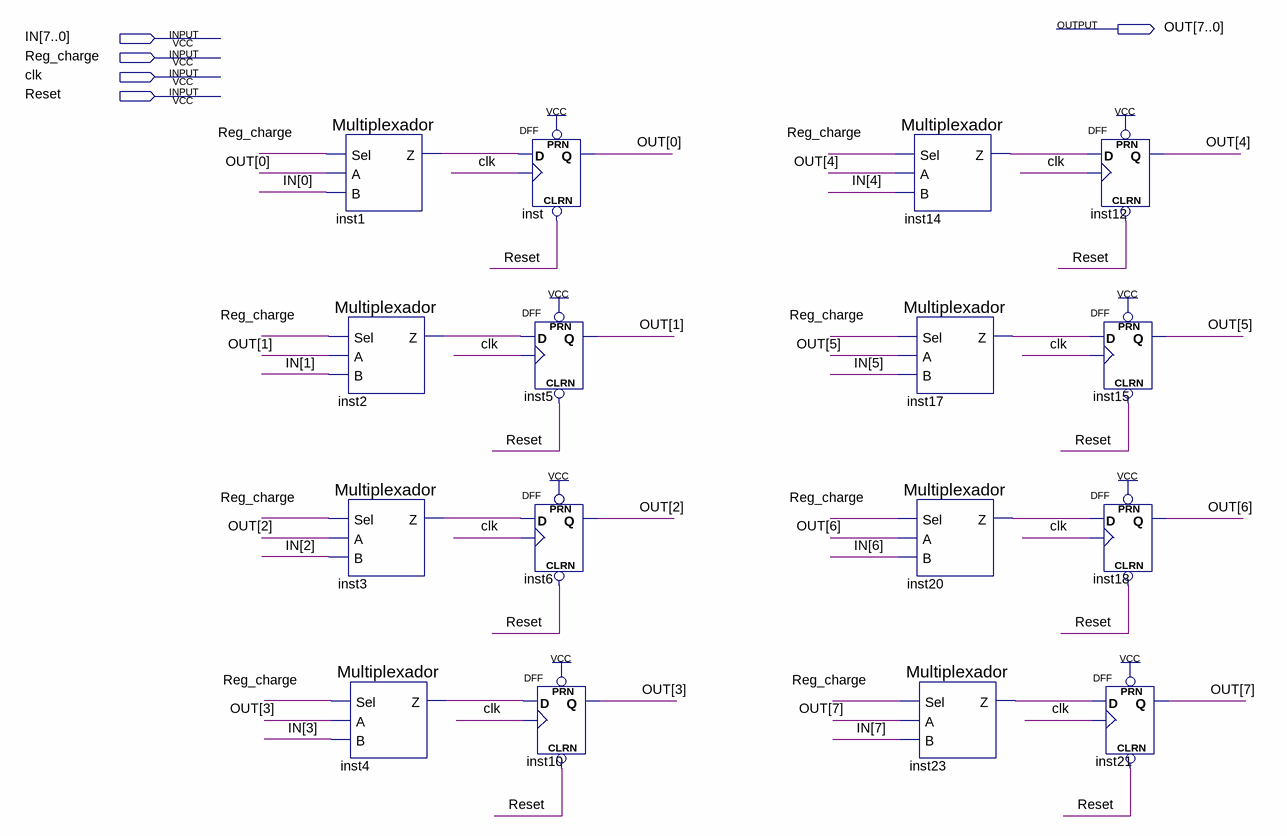
[diagram p0: schematic sheet]
// Quartus schematic REGISTER.bdf as structural Verilog: 16 symbols, 5 pins
module REGISTER (
  input  [7:0] IN,
  input  Reg_charge,
  input  clk,
  input  Reset,
  output [7:0] OUT
);

  wire inst1_z, inst2_z, inst3_z, inst4_z, inst14_z, inst17_z, inst20_z, inst23_z;

  Multiplexador inst1 (.Sel(Reg_charge), .A(OUT[0]), .B(IN[0]), .Z(inst1_z));
  Multiplexador inst2 (.Sel(Reg_charge), .A(OUT[1]), .B(IN[1]), .Z(inst2_z));
  Multiplexador inst3 (.Sel(Reg_charge), .A(OUT[2]), .B(IN[2]), .Z(inst3_z));
  Multiplexador inst4 (.Sel(Reg_charge), .A(OUT[3]), .B(IN[3]), .Z(inst4_z));
  DFF inst (.CLRN(Reset), .CLK(clk), .D(inst1_z), .PRN(1'b1), .Q(OUT[0]));
  DFF inst5 (.CLRN(Reset), .CLK(clk), .D(inst2_z), .PRN(1'b1), .Q(OUT[1]));
  DFF inst6 (.CLRN(Reset), .CLK(clk), .D(inst3_z), .PRN(1'b1), .Q(OUT[2]));
  DFF inst10 (.CLRN(Reset), .CLK(clk), .D(inst4_z), .PRN(1'b1), .Q(OUT[3]));
  Multiplexador inst14 (.Sel(Reg_charge), .A(OUT[4]), .B(IN[4]), .Z(inst14_z));
  Multiplexador inst17 (.Sel(Reg_charge), .A(OUT[5]), .B(IN[5]), .Z(inst17_z));
  Multiplexador inst20 (.Sel(Reg_charge), .A(OUT[6]), .B(IN[6]), .Z(inst20_z));
  Multiplexador inst23 (.Sel(Reg_charge), .A(OUT[7]), .B(IN[7]), .Z(inst23_z));
  DFF inst12 (.CLRN(Reset), .CLK(clk), .D(inst14_z), .PRN(1'b1), .Q(OUT[4]));
  DFF inst15 (.CLRN(Reset), .CLK(clk), .D(inst17_z), .PRN(1'b1), .Q(OUT[5]));
  DFF inst18 (.CLRN(Reset), .CLK(clk), .D(inst20_z), .PRN(1'b1), .Q(OUT[6]));
  DFF inst21 (.CLRN(Reset), .CLK(clk), .D(inst23_z), .PRN(1'b1), .Q(OUT[7]));
endmodule
